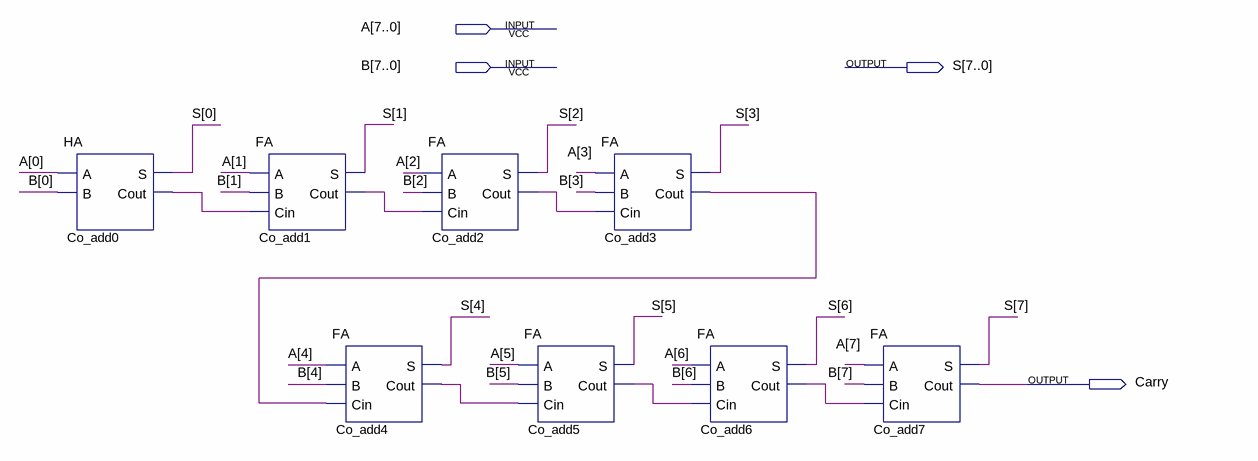
[diagram p0: schematic sheet]
// Quartus schematic RCA_8bits.bdf as structural Verilog: 8 symbols, 4 pins
module RCA_8bits (
  input  [7:0] A,
  input  [7:0] B,
  output [7:0] S,
  output Carry
);

  wire Co_add0_cout, Co_add1_cout, Co_add2_cout, Co_add3_cout, Co_add4_cout, Co_add5_cout, Co_add6_cout;

  HA Co_add0 (.A(A[0]), .B(B[0]), .S(S[0]), .Cout(Co_add0_cout));
  FA Co_add1 (.A(A[1]), .B(B[1]), .Cin(Co_add0_cout), .S(S[1]), .Cout(Co_add1_cout));
  FA Co_add4 (.A(A[4]), .B(B[4]), .Cin(Co_add3_cout), .S(S[4]), .Cout(Co_add4_cout));
  FA Co_add2 (.A(A[2]), .B(B[2]), .Cin(Co_add1_cout), .S(S[2]), .Cout(Co_add2_cout));
  FA Co_add5 (.A(A[5]), .B(B[5]), .Cin(Co_add4_cout), .S(S[5]), .Cout(Co_add5_cout));
  FA Co_add3 (.A(A[3]), .B(B[3]), .Cin(Co_add2_cout), .S(S[3]), .Cout(Co_add3_cout));
  FA Co_add6 (.A(A[6]), .B(B[6]), .Cin(Co_add5_cout), .S(S[6]), .Cout(Co_add6_cout));
  FA Co_add7 (.A(A[7]), .B(B[7]), .Cin(Co_add6_cout), .S(S[7]), .Cout(Carry));
endmodule
